# EAGLE design ENC28J60-Server_mod1 (EAGLE 5.01)
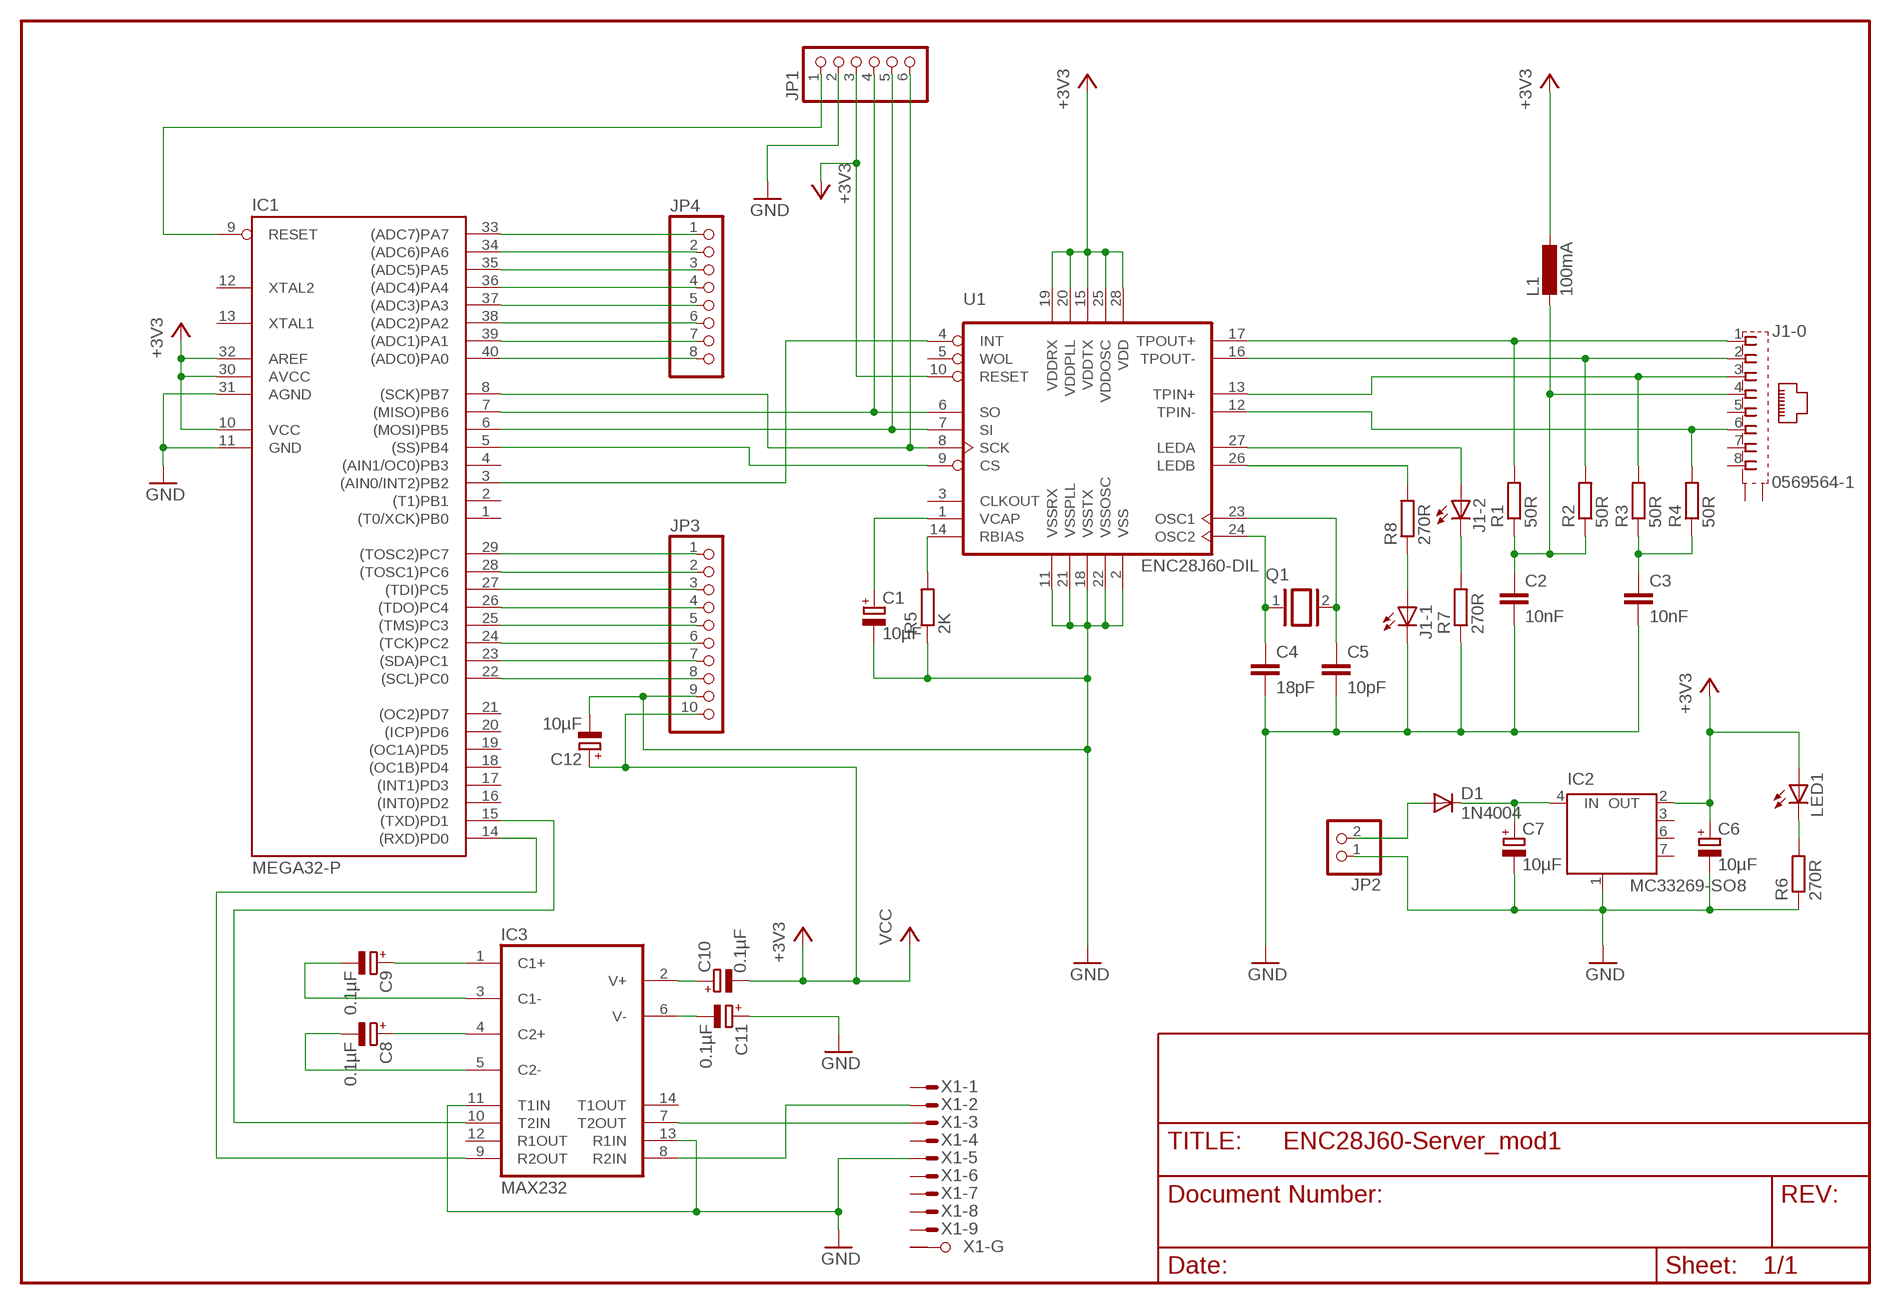
[diagram p0: schematic, sheet 1]

## Parts
C1  10µF  CPOL-EUE2.5-6  [E2,5-6]
C2  10nF  C-EU025-025X050  [C025-025X050]
C3  10nF  C-EU025-025X050  [C025-025X050]
C4  18pF  C-EU025-025X050  [C025-025X050]
C5  10pF  C-EU025-025X050  [C025-025X050]
C6  10µF  CPOL-EUE2.5-6  [E2,5-6]
C7  10µF  CPOL-EUE2.5-6  [E2,5-6]
C8  0.1µF  CPOL-EUE2.5-6  [E2,5-6]
C9  0.1µF  CPOL-EUE2.5-6  [E2,5-6]
C10  0.1µF  CPOL-EUE2.5-6  [E2,5-6]
C11  0.1µF  CPOL-EUE2.5-6  [E2,5-6]
C12  10µF  CPOL-EUE2.5-6  [E2,5-6]
D1  1N4004  [DO41-10]
IC1  MEGA32-P  [DIL40]
IC2  MC33269-SO8  [SO08]
IC3  MAX232  [DIL16]
J1  0569564-1  [0569564]
JP1  PINHD-1X6  [1X06]
JP2  PINHD-1X2  [1X02]
JP3  PINHD-1X10  [1X10]
JP4  PINHD-1X8  [1X08]
L1  100mA  L-EU0207/10  [0207/10]
LED1  LED3MM  [LED3MM]
Q1  XTAL/S  [QS]
R1  50R  R-EU_0207/10  [0207/10]
R2  50R  R-EU_0207/10  [0207/10]
R3  50R  R-EU_0207/10  [0207/10]
R4  50R  R-EU_0207/10  [0207/10]
R5  2K  R-EU_0207/10  [0207/10]
R6  270R  R-EU_0207/10  [0207/10]
R7  270R  R-EU_0207/10  [0207/10]
R8  270R  R-EU_0207/10  [0207/10]
U1  ENC28J60-DIL  [DIL28-3]
X1  M09HPS  [M09HP]

## Nets
+3V3 [power]: C6.+ C10.- C12.+ IC1.10(VCC) IC1.30(AVCC) IC1.32(AREF) IC2.2(OUT) JP1.3 JP3.10 L1.1 LED1.A U1.10(RESET) U1.15(VDDTX) U1.19(VDDRX) U1.20(VDDPLL) U1.25(VDDOSC) U1.28(VDD) ; supply symbol labelled VCC
GND [power]: C1.- C2.2 C3.2 C4.2 C5.2 C6.- C7.- C11.+ C12.- IC1.11(GND) IC1.31(AGND) IC2.1(GND/ADJ) IC3.11(T1IN) IC3.13(R1IN) J1.C1(-1:C) JP1.2 JP2.1 JP3.9 R5.1 R6.1 R7.1 U1.2(VSS) U1.11(VSSRX) U1.18(VSSTX) U1.21(VSSPLL) U1.22(VSSOSC) X1.5(-5:M)
N$1: IC3.7(T2OUT) X1.3(-3:M)
N$2: IC1.7((MISO)PB6) JP1.4 U1.6(SO)
N$3: IC1.6((MOSI)PB5) JP1.5 U1.7(SI)
N$4: IC1.5((SS)PB4) U1.9(CS)
N$5: IC1.3((AIN0/INT2)PB2) U1.4(INT)
N$6 [power]: D1.A JP2.2
N$7: C8.+ IC3.4(C2+)
N$8: C1.+ U1.1(VCAP)
N$9: IC1.9(RESET) JP1.1
N$10: J1.1 R1.2 U1.17(TPOUT+)
N$11: J1.2 R2.2 U1.16(TPOUT-)
N$12: R5.2 U1.14(RBIAS)
N$13: J1.3 R3.2 U1.13(TPIN+)
N$14: J1.6 R4.2 U1.12(TPIN-)
N$15: C2.1 J1.4 L1.2 R1.1 R2.1
N$16: C3.1 R3.1 R4.1
N$17: IC1.8((SCK)PB7) JP1.6 U1.8(SCK)
N$18: C8.- IC3.5(C2-)
N$19: C9.- IC3.3(C1-)
N$20: J1.A2(-2:A) U1.27(LEDA)
N$21: C4.1 Q1.1 U1.24(OSC2)
N$22: C5.1 Q1.2 U1.23(OSC1)
N$23: C9.+ IC3.1(C1+)
N$24: C10.+ IC3.2(V+)
N$25: C11.- IC3.6(V-)
N$26: IC3.8(R2IN) X1.2(-2:M)
N$27: IC1.33((ADC7)PA7) JP4.1
N$28: IC1.14((RXD)PD0) IC3.9(R2OUT)
N$29: IC1.15((TXD)PD1) IC3.10(T2IN)
N$30: IC1.29((TOSC2)PC7) JP3.1
N$31: IC1.28((TOSC1)PC6) JP3.2
N$32: IC1.27((TDI)PC5) JP3.3
N$33: IC1.26((TDO)PC4) JP3.4
N$34: IC1.25((TMS)PC3) JP3.5
N$35: IC1.24((TCK)PC2) JP3.6
N$36: IC1.23((SDA)PC1) JP3.7
N$37: IC1.22((SCL)PC0) JP3.8
N$42: J1.C2(-2:C) R7.2
N$43: IC1.34((ADC6)PA6) JP4.2
N$44: IC1.35((ADC5)PA5) JP4.3
N$45: IC1.36((ADC4)PA4) JP4.4
N$46: IC1.37((ADC3)PA3) JP4.5
N$47: IC1.38((ADC2)PA2) JP4.6
N$48: IC1.39((ADC1)PA1) JP4.7
N$49: IC1.40((ADC0)PA0) JP4.8
N$51 [power]: C7.+ D1.C IC2.4(IN)
N$52: LED1.K(C) R6.2
N$54: R8.2 U1.26(LEDB)
N$55: J1.A1(-1:A) R8.1
Unconnected: IC1.1((T0/XCK)PB0) IC1.2((T1)PB1) IC1.4((AIN1/OC0)PB3) IC1.12(XTAL2) IC1.13(XTAL1) IC1.16((INT0)PD2) IC1.17((INT1)PD3) IC1.18((OC1B)PD4) IC1.19((OC1A)PD5) IC1.20((ICP)PD6) IC1.21((OC2)PD7) IC2.3(OUT) IC2.6(OUT) IC2.7(OUT) IC3.12(R1OUT) IC3.14(T1OUT) J1.5 J1.7 J1.8 J1.S1(-0:S1) J1.S2(-0:S2) U1.3(CLKOUT) U1.5(WOL) X1.1(-1:M) X1.4(-4:M) X1.6(-6:M) X1.7(-7:M) X1.8(-8:M) X1.9(-9:M) X1.G1(-G:G1) X1.G2(-G:G2)

## Power pins joined to a net without a drawn wire
+3V3: IC3.16(VCC)
GND: IC3.15(GND)

## Library data of the parts
C1 C6-C12 = rcl:CPOL-EU: POLARIZED CAPACITOR, European symbol
C2-C5 = rcl:C-EU: CAPACITOR, European symbol
D1 = diode:1N4004: DIODE general purpose rectifier, 1 A
IC1 = atmel:MEGA32-P: MICROCONTROLLER 32 Kbytes FLASH 2 Kbytes SRAM 1 Kbytes EEPROM USART 8-channel 10 bit ADC Source: www.atmel.com .. doc2503.pdf
IC2 = linear:MC33269-SO8: Adjustable Output Low Dropout Voltage Regulator 800 mA Source: http://www.onsemi.com/pub/Collateral/MC33269-D.PDF
IC3 = maxim:MAX232: RS232 TRANSEIVER
J1 = con-amp:0569564-*: MODULAR JACK 8 POS., RIGHT ANGLE, LOW PROFILE WITH LEDS Source: http://ecommas.tycoelectronics.com/.. 569564_K.pdf
JP1 = pinhead:PINHD-1X6: PIN HEADER
JP2 = pinhead:PINHD-1X2: PIN HEADER
JP3 = pinhead:PINHD-1X10: PIN HEADER
JP4 = pinhead:PINHD-1X8: PIN HEADER
L1 = rcl:L-EU: INDUCTOR, European symbol
LED1 = led:LED: LED OSRAM: - CHIPLED LG R971, LG N971, LY N971, LG Q971, LY Q971, LO R971, LY R971 LH N974, LH R974 LS Q976, LO Q976, LY Q976 LO Q996 - Hyper CHIPLED LW Q18S LB Q993, LB Q99A, LB R99A - SideLED LS A670, LO A670, LY A670, LG A670, LP A670 LB A673, LV A673, LT A673, LW A673 LH A674 LY A675 LS A676, LA A676, LO A676, LY A676, LW A676 LS A679, LY A679, LG A679 - Hyper Micro SIDELED® LS Y876, LA Y876, LO Y876, LY Y876 LT Y87S - SmartLED LW L88C, LW L88S LB L89C, LB L89S, LG L890 LS L89K, LO L89K, LY L89K LS L896, LA L896, LO L896, LY L896 - TOPLED LS T670, LO T670, LY T670, LG T670, LP T670 LSG T670, LSP T670, LSY T670, LOP T670, LYG T670 LG T671, LOG T671, LSG T671 LB T673, LV T673, LT T673, LW T673 LH T674 LS T676, LA T676, LO T676, LY T676, LB T676, LH T676, LSB T676, LW T676 LB T67C, LV T67C, LT T67C, LS T67K, LO T67K, LY T67K, LW E67C LS E67B, LA E67B, LO E67B, LY E67B, LB E67C, LV E67C, LT E67C LW T67C LS T679, LY T679, LG T679 LS T770, LO T770, LY T770, LG T770, LP T770 LB T773, LV T773, LT T773, LW T773 LH T774 LS E675, LA E675, LY E675, LS T675 LS T776, LA T776, LO T776, LY T776, LB T776 LHGB T686 LT T68C, LB T68C - Hyper Mini TOPLED® LB M676 - Mini TOPLED Santana® LG M470 LS M47K, LO M47K, LY M47K Source: http://www.osram.convergy.de - LUMILED® LXK2-PW12-R00, LXK2-PW12-S00, LXK2-PW14-U00, LXK2-PW14-V00 LXK2-PM12-R00, LXK2-PM12-S00, LXK2-PM14-U00 LXK2-PE12-Q00, LXK2-PE12-R00, LXK2-PE12-S00, LXK2-PE14-T00, LXK2-PE14-U00 LXK2-PB12-K00, LXK2-PB12-L00, LXK2-PB12-M00, LXK2-PB14-N00, LXK2-PB14-P00, LXK2-PB14-Q00 LXK2-PR12-L00, LXK2-PR12-M00, LXK2-PR14-Q00, LXK2-PR14-R00 LXK2-PD12-Q00, LXK2-PD12-R00, LXK2-PD12-S00 LXK2-PH12-R00, LXK2-PH12-S00 LXK2-PL12-P00, LXK2-PL12-Q00, LXK2-PL12-R00 Source: www.luxeon.com
Q1 = special:XTAL/S: CRYSTAL
R1-R8 = rcl:R-EU_: RESISTOR, European symbol
U1 = microchip-enc28j60:ENC28J60-*: Microchip 10Mbit Eth. contoller with SPI interface
X1 = con-subd:M09HPS: SUB-D

## Net classes
1 power: width 0.356 mm

## Board
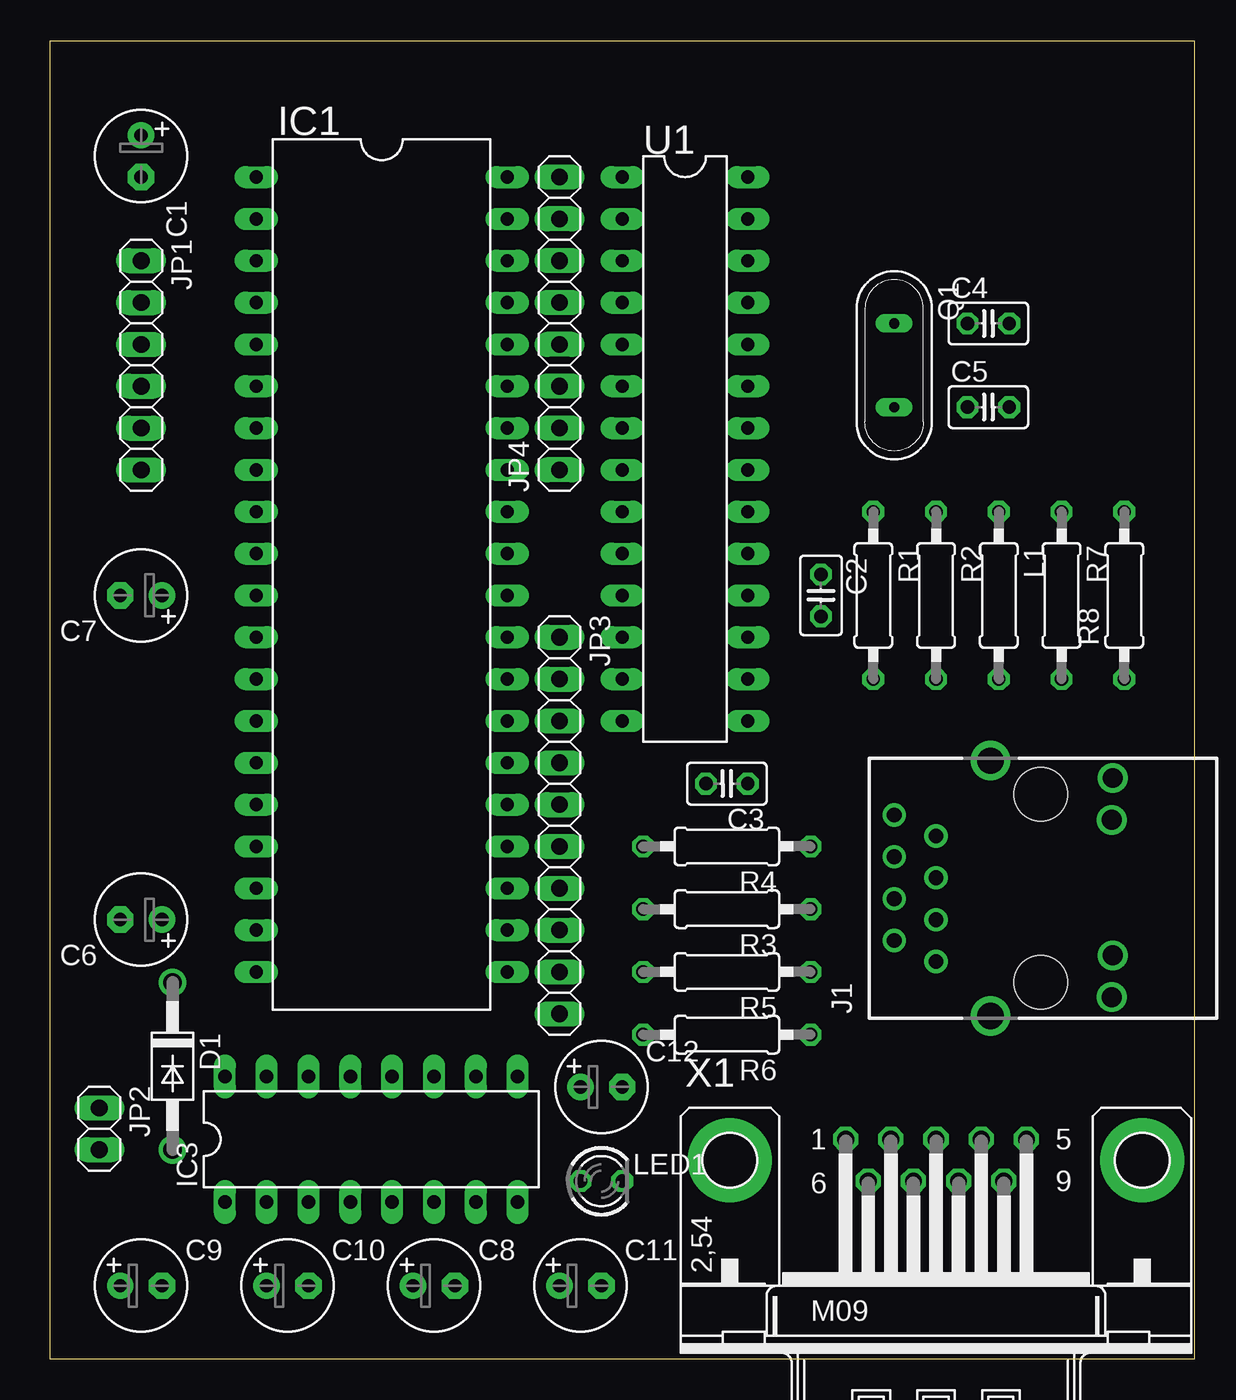
[diagram p1: board, top side]
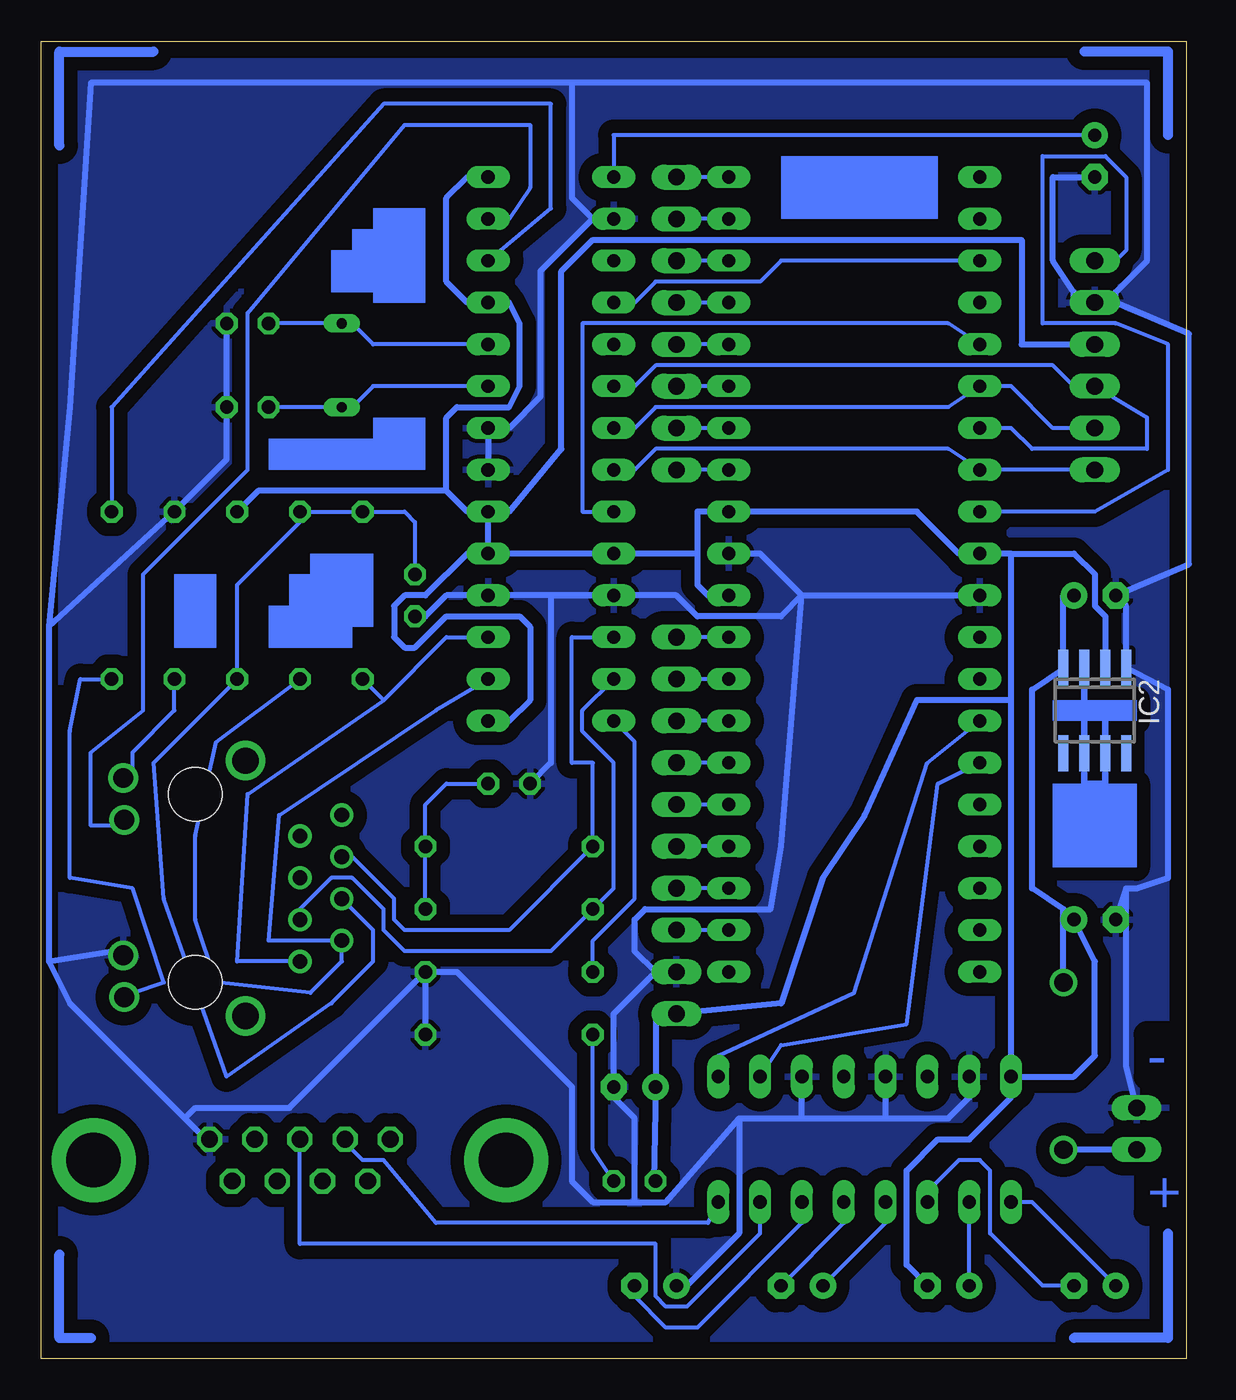
[diagram p2: board, bottom side, seen from below]

Size 69.52 x 80 mm. Coordinates in mm from the lower left corner, seen from the top.
Outline: 0,0 69.52,0 69.52,80 0,80 0,0
Copper layers (1*16): Top 0.035mm / dielectric 1.5mm / Bottom 0.035mm
Design rules "default": minimum track width 10mil, minimum drill 24mil, track to track 8mil, track to pad 8mil, pad to pad 8mil, via to via 8mil, smd to smd 8mil, copper to edge 40mil, drill to drill 8mil, minimum pad ring 10mil, minimum via ring 8mil, stop-mask expansion 4mil, vias tented up to drill 0mil, thermal gap 10mil

### Footprints (pad centres in the part's own frame; a part is rotated, then mirrored left to right if it is on the bottom)
E2,5-6 = drill 0.813 pad 1.6 round: + -1.27,0 | drill 0.813 pad 1.6 octagon: - 1.27,0
C025-025X050 = drill 0.813 octagon: 1 -1.27,0; 2 1.27,0
DO41-10 = drill 1.118 round: A 5.08,0; C -5.08,0
DIL40 = drill 0.813 long: 1 -24.13,-7.62; 2 -21.59,-7.62; 3 -19.05,-7.62; 4 -16.51,-7.62; 5 -13.97,-7.62; 6 -11.43,-7.62; 7 -8.89,-7.62; 8 -6.35,-7.62; 9 -3.81,-7.62; 10 -1.27,-7.62; 11 1.27,-7.62; 12 3.81,-7.62; 13 6.35,-7.62; 14 8.89,-7.62; 15 11.43,-7.62; 16 13.97,-7.62; 17 16.51,-7.62; 18 19.05,-7.62; 19 21.59,-7.62; 20 24.13,-7.62; 21 24.13,7.62; 22 21.59,7.62; 23 19.05,7.62; 24 16.51,7.62; 25 13.97,7.62; 26 11.43,7.62; 27 8.89,7.62; 28 6.35,7.62; 29 3.81,7.62; 30 1.27,7.62; 31 -1.27,7.62; 32 -3.81,7.62; 33 -6.35,7.62; 34 -8.89,7.62; 35 -11.43,7.62; 36 -13.97,7.62; 37 -16.51,7.62; 38 -19.05,7.62; 39 -21.59,7.62; 40 -24.13,7.62
SO08 = smd 0.6 x 2.2: 1 -1.905,-2.6; 2 -0.635,-2.6; 3 0.635,-2.6; 4 1.905,-2.6; 5 1.905,2.6; 6 0.635,2.6; 7 -0.635,2.6; 8 -1.905,2.6
DIL16 = drill 0.813 long: 1 -8.89,-3.81; 2 -6.35,-3.81; 3 -3.81,-3.81; 4 -1.27,-3.81; 5 1.27,-3.81; 6 3.81,-3.81; 7 6.35,-3.81; 8 8.89,-3.81; 9 8.89,3.81; 10 6.35,3.81; 11 3.81,3.81; 12 1.27,3.81; 13 -1.27,3.81; 14 -3.81,3.81; 15 -6.35,3.81; 16 -8.89,3.81
0569564 = drill 0.9 round: 1 -4.445,6.35; 2 -3.175,8.89; 3 -1.905,6.35; 4 -0.635,8.89; 5 0.635,6.35; 6 1.905,8.89; 7 3.175,6.35; 8 4.445,8.89 | drill 1.2 round: A1 -6.612,-4.32; A2 4.152,-4.32; C1 -4.072,-4.378; C2 6.692,-4.378 | drill 1.6 round: S1 -7.745,3.05; S2 7.745,3.05 | hole 3.25: -5.715,0; 5.715,0
1X06 = drill 1.016 long: 1 -6.35,0; 2 -3.81,0; 3 -1.27,0; 4 1.27,0; 5 3.81,0; 6 6.35,0
1X02 = drill 1.016 long: 1 -1.27,0; 2 1.27,0
1X10 = drill 1.016 long: 1 -11.43,0; 2 -8.89,0; 3 -6.35,0; 4 -3.81,0; 5 -1.27,0; 6 1.27,0; 7 3.81,0; 8 6.35,0; 9 8.89,0; 10 11.43,0
1X08 = drill 1.016 long: 1 -8.89,0; 2 -6.35,0; 3 -3.81,0; 4 -1.27,0; 5 1.27,0; 6 3.81,0; 7 6.35,0; 8 8.89,0
0207/10 = drill 0.813 octagon: 1 -5.08,0; 2 5.08,0
LED3MM = drill 0.813 octagon: A -1.27,0; K 1.27,0
QS = drill 0.61 long: 1 -2.54,0; 2 2.54,0
DIL28-3 = drill 0.813 long: 1 -16.51,-3.81; 2 -13.97,-3.81; 3 -11.43,-3.81; 4 -8.89,-3.81; 5 -6.35,-3.81; 6 -3.81,-3.81; 7 -1.27,-3.81; 8 1.27,-3.81; 9 3.81,-3.81; 10 6.35,-3.81; 11 8.89,-3.81; 12 11.43,-3.81; 13 13.97,-3.81; 14 16.51,-3.81; 15 16.51,3.81; 16 13.97,3.81; 17 11.43,3.81; 18 8.89,3.81; 19 6.35,3.81; 20 3.81,3.81; 21 1.27,3.81; 22 -1.27,3.81; 23 -3.81,3.81; 24 -6.35,3.81; 25 -8.89,3.81; 26 -11.43,3.81; 27 -13.97,3.81; 28 -16.51,3.81
M09HP = drill 1.016 octagon: 1 -5.486,1.27; 2 -2.743,1.27; 3 0,1.27; 4 2.743,1.27; 5 5.486,1.27; 6 -4.115,-1.27; 7 -1.372,-1.27; 8 1.372,-1.27; 9 4.115,-1.27 | drill 3.302 pad 5.08 round: G1 -12.522,0; G2 12.522,0

### Placement (x,y rotation side)
C1  5.55,73.02 270 top
C2  46.82,46.35 270 top
C3  41.11,34.92 180 top
C4  56.98,62.86 0 top
C5  56.98,57.78 0 top
C6  5.55,26.66 180 top
C7  5.55,46.35 180 top
C8  23.33,4.44 0 top
C9  5.55,4.44 0 top
C10  14.44,4.44 0 top
C11  32.22,4.44 0 top
C12  33.49,16.5 0 top
D1  7.46,17.77 270 top
IC1  20.15,47.62 270 top
IC2  5.55,39.37 180 bottom
IC3  19.52,13.33 0 top
J1  60.16,28.57 90 top
JP1  5.55,60.32 270 top
JP2  3.01,13.97 270 top
JP3  30.95,32.38 270 top
JP4  30.95,62.86 90 top
L1  57.62,46.35 270 top
LED1  33.49,10.79 0 top
Q1  51.27,60.32 270 top
R1  50,46.35 270 top
R2  53.81,46.35 270 top
R3  41.11,27.3 180 top
R4  41.11,31.11 180 top
R5  41.11,23.49 180 top
R6  41.11,19.68 180 top
R7  61.43,46.35 270 top
R8  65.24,46.35 90 top
U1  38.57,55.24 270 top
X1  53.81,12.06 0 top

### Tracks (layer width: path | path; a pad name or v marks a point on that pad's centre or on a via)
+3V3
  Bottom 0.356: IC2.2 4.92,45.08 5.55,45.72 5.55,47.62 6.82,48.89 10.63,48.89 | C10.- 16.98,5.71 16.98,11.43 15.08,13.33 13.17,13.33 10.63,15.87 IC3.16 | C6.+ 5.55,24.12 5.55,18.41 6.82,17.14 IC3.16 | IC3.16 10.63,40 | 10.63,40 10.63,48.89 | 10.63,48.89 IC1.10 13.81,48.89 16.34,51.43 IC1.32 29.68,51.43 | 29.68,51.43 29.68,46.98 29.04,46.35 IC1.30 | 29.68,51.43 29.68,48.89 U1.10 U1.19 | U1.28 43.65,71.75 44.92,70.48 44.92,65.4 43.65,64.13 U1.25 41.11,64.13 40.48,62.86 40.48,59.05 41.11,57.78 44.28,57.78 44.92,57.15 44.92,52.7 | U1.15 41.11,38.73 39.84,40 39.84,44.45 40.48,45.08 44.92,45.08 46.82,43.18 47.46,43.18 48.09,43.81 48.09,45.72 47.46,46.35 46.19,46.35 43.65,48.89 U1.19 | U1.19 U1.20 | L1.1 56.35,52.7 44.92,52.7 | 44.92,52.7 43.65,51.43 U1.20 | JP1.3 10,61.59 10,67.94 36.03,67.94 37.94,66.03 37.94,55.24 41.11,51.43 U1.20 | 10.63,40 16.34,40 19.52,33.02 22.06,29.2 24.6,21.58 JP3.10 32.22,20.95 C12.+ 32.34,10.81 LED1.A
GND
  Bottom 0.356: C1.- 8.09,71.75 8.09,66.67 6.82,64.77 6.82,64.13 JP1.2 4.28,64.13 | 3.64,28.57 3.01,28.57 1.1,29.2 1.1,40.64 IC2.1 3.64,45.72 C7.- -0.17,48.26 -0.17,62.23 4.28,64.13 | 23.33,46.35 25.87,48.89 IC1.31 | 23.33,46.35 IC1.11 | 38.57,46.35 U1.11 | 38.57,46.35 U1.18 44.92,46.35 46.19,45.08 C2.2 | 38.57,46.35 38.57,36.19 C3.2 | U1.21 U1.22 41.11,56.51 39.2,58.41 39.2,66.03 36.03,69.21 | 37.3,77.46 37.3,70.48 36.03,69.21 | 37.3,77.46 66.51,77.46 67.78,57.78 69.05,44.45 | 36.03,69.21 U1.2 | 27.14,14.6 23.33,14.6 | 23.33,14.6 18.25,14.6 | 18.25,14.6 14.44,14.6 13.17,15.87 IC3.15 | 33.49,9.52 31.58,9.52 27.14,14.6 | 60.8,14.6 59.52,13.33 59.52,12.7 X1.5 | 27.14,14.6 27.14,7.62 30.31,4.44 C11.+ | 4.28,64.13 4.28,64.77 2.38,66.67 2.38,77.46 37.3,77.46 | 32.22,23.49 JP3.9 | 58.25,54.61 C5.2 C4.2 58.25,54.61 | 3.64,28.57 3.64,17.77 JP2.1 | 3.64,28.57 C6.- | 58.25,54.61 R7.1 69.05,44.45 | 38.57,46.35 30.95,46.35 29.68,45.08 24.6,45.08 23.33,46.35 | 23.33,46.35 24.6,31.11 25.23,27.3 32.85,27.3 33.49,26.66 33.49,24.76 32.22,23.49 | 33.49,9.52 33.49,14.6 34.76,15.87 C12.- 34.76,20.95 32.22,23.49 | 60.8,14.6 60.16,15.24 54.45,15.24 R5.1 | R5.1 44.28,23.49 37.3,16.5 37.3,10.79 36.03,9.52 33.49,9.52 | 60.8,14.6 67.78,21.58 69.05,24.12 | 69.05,44.45 69.05,24.12 | R5.1 R6.1 | 69.05,24.12 65.24,24.76 J1.C1 | 18.25,14.6 IC3.13 | 23.33,14.6 IC3.11
  pour Bottom (isolate 0.813): -6.52,81.91 73.5,81.91 73.5,79.37 72.22,79.37 72.22,-5.72 -12.23,-5.72 -12.23,-6.99 -17.31,-6.99 -17.31,82.55 -6.52,82.55
N$1
  Bottom 0.254: IC3.7 25.87,7.62 30.31,3.17 31.58,3.17 32.22,3.8 32.22,6.98 53.81,6.98 X1.3
N$2
  Bottom 0.254: IC1.7 10.63,56.51 9.36,55.24 2.38,55.24 2.38,57.15 JP1.4 6.82,59.05 8.09,60.32 32.22,60.32 33.49,59.05 U1.6
N$3
  Bottom 0.254: U1.7 33.49,56.51 32.22,57.78 14.44,57.78 IC1.6 10.63,59.05 8.09,56.51 JP1.5
N$4
  Bottom 0.254: IC1.5 14.44,62.86 36.66,62.86 36.66,51.43 U1.9
N$5
  Bottom 0.254: IC1.3 24.6,66.67 25.87,65.4 32.22,65.4 33.49,64.13 U1.4
N$6
  Bottom 0.356: JP2.2 D1.A
N$7
  Bottom 0.254: C8.+ 18.25,8.25 IC3.4
N$8
  Bottom 0.254: U1.1 34.76,74.29 C1.+
N$9
  Bottom 0.254: IC1.9 5.55,51.43 1.1,53.97 1.1,61.59 4.28,62.86 8.73,62.86 8.73,73.02 4.92,73.02 3.64,71.75 3.64,67.3 4.28,66.67 JP1.1
N$10
  Bottom 0.254: 48.73,40 44.92,43.81 U1.17 | 48.73,40 R1.2 | 48.73,40 56.98,34.29 57.62,24.12 J1.1
N$11
  Bottom 0.254: U1.16 45.55,39.37 55.08,33.02 55.71,25.39 J1.2 51.27,24.12 53.17,22.22 58.89,22.86 60.16,26.66 60.16,31.74 58.89,37.46 R2.2
N$12
  Bottom 0.254: R5.2 36.03,25.39 33.49,27.93 33.49,37.46 U1.14
N$13
  Bottom 0.254: U1.13 36.66,39.37 36.66,38.1 34.76,36.19 34.76,28.57 R3.2 38.57,24.76 47.46,24.76 48.73,26.03 48.73,27.3 50.63,29.2 51.91,29.2 53.81,27.3 J1.3
N$14
  Bottom 0.254: U1.12 37.3,43.81 37.3,36.19 36.03,36.19 R4.2 41.11,26.03 47.46,26.03 48.09,26.66 48.09,27.93 50.63,30.47 J1.6
N$15
  Bottom 0.254: C2.1 46.82,50.8 47.46,51.43 R1.1 R2.1 53.81,50.8 57.62,46.98 L1.2 62.7,36.19 62.06,27.93 58.25,17.14 51.91,21.58 49.37,24.12 49.37,26.03 J1.4
N$16
  Bottom 0.254: R3.1 R4.1 46.19,33.65 44.92,34.92 C3.1
N$17
  Bottom 0.254: U1.8 33.49,53.97 32.22,55.24 14.44,55.24 IC1.8 JP1.6
N$18
  Bottom 0.254: C8.- 20.79,8.25 IC3.5
N$19
  Bottom 0.254: IC3.3 15.71,10.16 13.81,12.06 12.54,12.06 11.9,11.43 11.9,7.62 8.73,4.44 C9.-
N$20
  Bottom 0.254: U1.27 41.11,69.21 39.84,71.11 39.84,74.92 47.46,74.92 56.98,63.5 56.98,53.97 63.34,47.62 63.34,39.37 66.51,36.83 66.51,32.38 65.24,32.38 J1.A2
N$21
  Bottom 0.254: C4.1 Q1.1 50.63,62.86 49.37,61.59 U1.24
N$22
  Bottom 0.254: C5.1 Q1.2 50.63,57.78 49.37,59.05 U1.23
N$23
  Bottom 0.254: IC3.1 9.36,9.52 C9.+
N$24
  Bottom 0.254: C10.+ IC3.2
N$25
  Bottom 0.254: IC3.6 23.33,8.25 29.68,1.9 31.58,1.9 33.49,3.8 C11.-
N$26
  Bottom 0.254: IC3.8 29.04,8.25 45.55,8.25 48.73,12.06 50,12.06 50.63,12.7 X1.2
N$27
  Bottom 0.254: IC1.33 JP4.1
N$28
  Bottom 0.254: IC3.9 28.41,18.41 20.15,22.22 15.71,36.19 IC1.14
N$29
  Bottom 0.254: IC3.10 24.6,19.04 16.98,20.31 15.08,34.92 IC1.15
N$30
  Bottom 0.254: IC1.29 JP3.1
N$31
  Bottom 0.254: IC1.28 JP3.2
N$32
  Bottom 0.254: IC1.27 JP3.3
N$33
  Bottom 0.254: IC1.26 JP3.4
N$34
  Bottom 0.254: IC1.25 JP3.5
N$35
  Bottom 0.254: IC1.24 JP3.6
N$36
  Bottom 0.254: IC1.23 JP3.7
N$37
  Bottom 0.254: IC1.22 JP3.8
N$38
  Bottom 0.61: 1.1,7.62 1.1,1.27 6.82,1.27
N$39
  Bottom 0.61: 68.41,6.34 68.41,1.27 66.51,1.27
N$40
  Bottom 0.61: 62.7,79.37 68.41,79.37 68.41,73.66
N$41
  Bottom 0.61: 6.18,79.37 1.1,79.37 1.1,74.29
N$42
  Bottom 0.254: R7.2 61.43,39.37 63.97,36.83 63.97,35.55 J1.C2
N$43
  Bottom 0.254: IC1.34 JP4.2
N$44
  Bottom 0.254: IC1.35 JP4.3
N$45
  Bottom 0.254: IC1.36 JP4.4
N$46
  Bottom 0.254: IC1.37 JP4.5
N$47
  Bottom 0.254: IC1.38 JP4.6
N$48
  Bottom 0.254: IC1.39 JP4.7
N$49
  Bottom 0.254: IC1.40 JP4.8
N$50
  Bottom 0.406: 4.92,35.55 4.92,34.92 6.18,34.92 6.18,35.55
N$51
  Bottom 0.356: C7.+ 7.46,46.35 IC2.4 7.46,41.91 9.36,40.64 9.36,28.57 7.46,27.3 D1.C
N$52
  Bottom 0.254: LED1.K 36.03,12.7 R6.2
N$53
  Bottom 0.406: 6.18,39.37 6.18,41.27 | 6.18,39.37 6.18,37.46 | 6.18,39.37 4.92,39.37 4.92,37.46
N$54
  Bottom 0.254: U1.26 38.57,69.84 38.57,76.19 48.73,76.19 65.24,57.78 R8.2
N$55
  Bottom 0.254: R8.1 67.14,41.27 67.78,38.1 67.78,29.2 63.97,28.57 62.06,22.86 63.97,22.22 J1.A1
(copper drawn outside any net)
  shapes: Bottom area x15

### Text on the board
Bottom: - | +